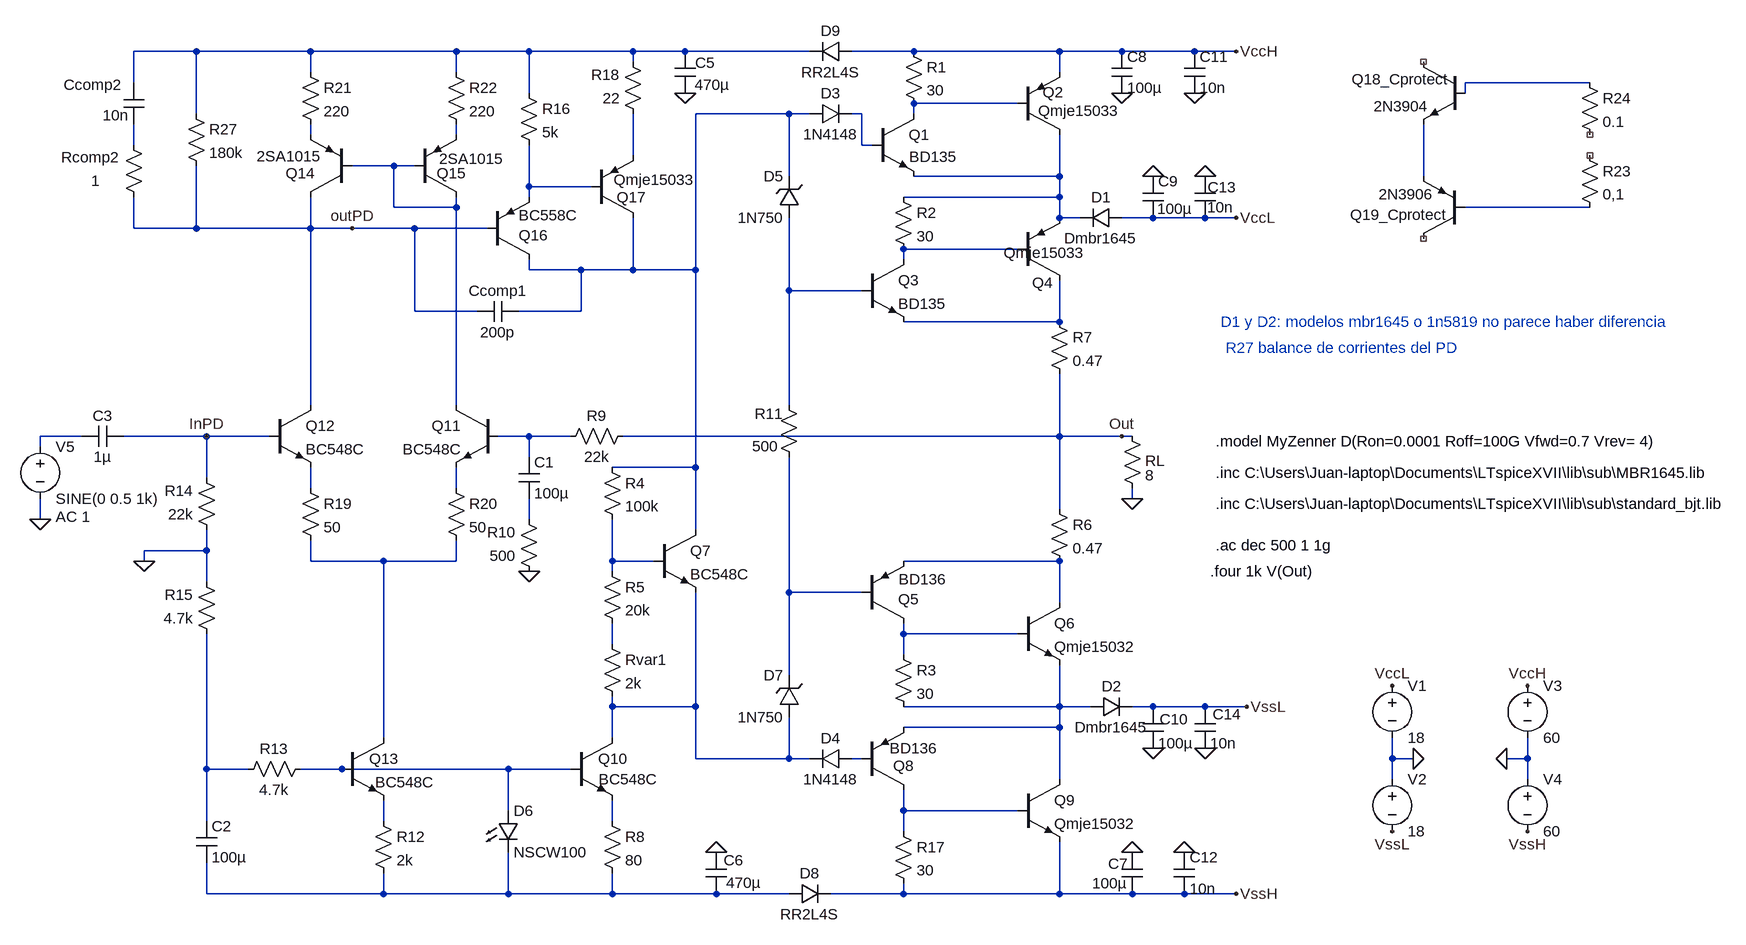
[diagram p0: schematic etapa_ampli_2Sziklai_mas_tension.asc]
etapa_ampli_2Sziklai_mas_tension.asc, the LTspice schematic file:
Version 4
SHEET 1 1872 1408
WIRE -912 48 -1008 48
WIRE -736 48 -912 48
WIRE -512 48 -736 48
WIRE -400 48 -512 48
WIRE -240 48 -400 48
WIRE -160 48 -240 48
WIRE 32 48 -160 48
WIRE 192 48 96 48
WIRE 416 48 192 48
WIRE 512 48 416 48
WIRE 624 48 512 48
WIRE 688 48 624 48
WIRE -240 64 -240 48
WIRE -736 80 -736 48
WIRE -512 80 -512 48
WIRE 416 80 416 48
WIRE -1008 96 -1008 48
WIRE 1232 96 1040 96
WIRE -400 112 -400 48
WIRE 1040 112 1040 96
WIRE 352 128 192 128
WIRE -912 144 -912 48
WIRE 0 144 -144 144
WIRE 32 144 0 144
WIRE 112 144 96 144
WIRE 192 144 192 128
WIRE -736 176 -736 160
WIRE -512 176 -512 160
WIRE -1008 192 -1008 160
WIRE 112 192 112 144
WIRE 128 192 112 192
WIRE -240 208 -240 144
WIRE -608 224 -672 224
WIRE -576 224 -608 224
WIRE 0 240 0 144
WIRE 416 240 416 176
WIRE 416 240 192 240
WIRE 976 240 976 160
WIRE -400 256 -400 192
WIRE -304 256 -400 256
WIRE -400 272 -400 256
WIRE 416 272 416 240
WIRE 416 272 176 272
WIRE -608 288 -608 224
WIRE -512 288 -512 272
WIRE -512 288 -608 288
WIRE 1232 288 1040 288
WIRE 416 304 416 272
WIRE 448 304 416 304
WIRE 560 304 512 304
WIRE 640 304 560 304
WIRE 688 304 640 304
WIRE -1008 320 -1008 272
WIRE -912 320 -912 224
WIRE -912 320 -1008 320
WIRE -736 320 -736 272
WIRE -736 320 -912 320
WIRE -672 320 -736 320
WIRE -576 320 -672 320
WIRE -464 320 -576 320
WIRE 352 352 176 352
WIRE 176 368 176 352
WIRE -400 384 -400 368
WIRE -320 384 -400 384
WIRE -240 384 -240 304
WIRE -240 384 -320 384
WIRE -144 384 -144 144
WIRE -144 384 -240 384
WIRE 0 416 0 304
WIRE 112 416 0 416
WIRE -576 448 -576 320
WIRE -480 448 -576 448
WIRE -320 448 -320 384
WIRE -320 448 -416 448
WIRE 416 464 416 400
WIRE 416 464 176 464
WIRE -736 592 -736 320
WIRE -512 592 -512 288
WIRE 0 592 0 416
WIRE -1088 640 -1152 640
WIRE -896 640 -1024 640
WIRE -800 640 -896 640
WIRE -400 640 -448 640
WIRE -336 640 -400 640
WIRE 416 640 416 544
WIRE 416 640 -256 640
WIRE 512 640 416 640
WIRE 528 640 512 640
WIRE -1152 656 -1152 640
WIRE -400 672 -400 640
WIRE -144 688 -144 384
WIRE -144 688 -272 688
WIRE -896 704 -896 640
WIRE -736 720 -736 688
WIRE -512 720 -512 688
WIRE 528 736 528 720
WIRE 416 752 416 640
WIRE -1152 768 -1152 736
WIRE -400 768 -400 736
WIRE -144 784 -144 688
WIRE -896 816 -896 784
WIRE -896 816 -992 816
WIRE -992 832 -992 816
WIRE -736 832 -736 800
WIRE -624 832 -736 832
WIRE -512 832 -512 800
WIRE -512 832 -624 832
WIRE -272 832 -272 768
WIRE -208 832 -272 832
WIRE 416 832 176 832
WIRE -272 848 -272 832
WIRE -896 864 -896 816
WIRE 0 880 0 672
WIRE 112 880 0 880
WIRE 416 896 416 832
WIRE 176 944 176 928
WIRE 352 944 176 944
WIRE -272 960 -272 928
WIRE 176 976 176 944
WIRE 0 1008 0 880
WIRE -272 1056 -272 1040
WIRE -144 1056 -144 880
WIRE -144 1056 -272 1056
WIRE 416 1056 416 992
WIRE 416 1056 176 1056
WIRE 464 1056 416 1056
WIRE 560 1056 528 1056
WIRE 640 1056 560 1056
WIRE 704 1056 640 1056
WIRE 416 1088 416 1056
WIRE 416 1088 176 1088
WIRE -624 1104 -624 832
WIRE -272 1104 -272 1056
WIRE -144 1136 -144 1056
WIRE 0 1136 0 1072
WIRE 0 1136 -144 1136
WIRE 32 1136 0 1136
WIRE 112 1136 96 1136
WIRE 928 1136 928 1104
WIRE 960 1136 928 1136
WIRE 1136 1136 1136 1104
WIRE 1136 1136 1104 1136
WIRE -896 1152 -896 944
WIRE -832 1152 -896 1152
WIRE -688 1152 -752 1152
WIRE -432 1152 -688 1152
WIRE -336 1152 -432 1152
WIRE 416 1168 416 1088
WIRE 928 1168 928 1136
WIRE 1136 1168 1136 1136
WIRE -432 1216 -432 1152
WIRE 176 1216 176 1184
WIRE 352 1216 176 1216
WIRE -896 1232 -896 1152
WIRE -624 1232 -624 1200
WIRE -272 1232 -272 1200
WIRE 176 1248 176 1216
WIRE -896 1344 -896 1296
WIRE -624 1344 -624 1312
WIRE -624 1344 -896 1344
WIRE -432 1344 -432 1280
WIRE -432 1344 -624 1344
WIRE -272 1344 -272 1312
WIRE -272 1344 -432 1344
WIRE -112 1344 -272 1344
WIRE 0 1344 -112 1344
WIRE 176 1344 176 1328
WIRE 176 1344 64 1344
WIRE 416 1344 416 1264
WIRE 416 1344 176 1344
WIRE 528 1344 416 1344
WIRE 608 1344 528 1344
WIRE 688 1344 608 1344
FLAG 688 304 VccL
FLAG 688 48 VccH
FLAG 528 736 0
FLAG 688 1344 VssH
FLAG 960 1136 0
FLAG 1104 1136 0
FLAG 1136 1024 VccH
FLAG 928 1024 VccL
FLAG 1136 1248 VssH
FLAG 928 1248 VssL
FLAG 512 640 Out
FLAG -400 848 0
FLAG -992 832 0
FLAG 704 1056 VssL
FLAG -896 640 InPD
FLAG -160 112 0
FLAG -112 1280 0
FLAG 560 1120 0
FLAG 528 1280 0
FLAG 560 240 0
FLAG 512 112 0
FLAG 624 112 0
FLAG 608 1280 0
FLAG 640 240 0
FLAG 640 1120 0
FLAG -672 320 outPD
FLAG -1152 768 0
SYMBOL npn 128 144 R0
WINDOW 3 57 66 Left 2
SYMATTR Value BD135
SYMATTR InstName Q1
SYMBOL npn 112 368 R0
SYMATTR InstName Q3
SYMATTR Value BD135
SYMBOL res 512 624 R0
WINDOW 0 36 54 Left 2
SYMATTR InstName RL
SYMATTR Value 8
SYMBOL pnp 112 928 M180
WINDOW 0 56 37 Left 2
WINDOW 3 57 68 Left 2
SYMATTR InstName Q5
SYMATTR Value BD136
SYMBOL pnp 112 1184 M180
WINDOW 0 48 37 Left 2
WINDOW 3 43 64 Left 2
SYMATTR InstName Q8
SYMATTR Value BD136
SYMBOL voltage 928 1008 R0
WINDOW 123 0 0 Left 0
WINDOW 39 0 0 Left 0
SYMATTR InstName V1
SYMATTR Value 18
SYMBOL voltage 928 1152 R0
WINDOW 123 0 0 Left 0
WINDOW 39 0 0 Left 0
SYMATTR InstName V2
SYMATTR Value 18
SYMBOL voltage 1136 1008 R0
WINDOW 123 0 0 Left 0
WINDOW 39 0 0 Left 0
SYMATTR InstName V3
SYMATTR Value 60
SYMBOL voltage 1136 1152 R0
WINDOW 123 0 0 Left 0
WINDOW 39 0 0 Left 0
SYMATTR InstName V4
SYMATTR Value 60
SYMBOL diode 32 160 R270
WINDOW 0 32 32 VTop 2
WINDOW 3 0 32 VBottom 2
SYMATTR InstName D3
SYMATTR Value 1N4148
SYMBOL diode 96 1120 R90
WINDOW 0 0 32 VBottom 2
WINDOW 3 32 32 VTop 2
SYMATTR InstName D4
SYMATTR Value 1N4148
SYMBOL npn -208 784 R0
SYMATTR InstName Q7
SYMATTR Value BC548C
SYMBOL res -288 672 R0
SYMATTR InstName R4
SYMATTR Value 100k
SYMBOL res -288 832 R0
SYMATTR InstName R5
SYMATTR Value 20k
SYMBOL npn -336 1104 R0
WINDOW 0 42 32 Left 2
WINDOW 3 43 64 Left 2
SYMATTR InstName Q10
SYMATTR Value BC548C
SYMBOL res -288 1216 R0
SYMATTR InstName R8
SYMATTR Value 80
SYMBOL npn -448 592 M0
SYMATTR InstName Q11
SYMATTR Value BC548C
SYMBOL res -240 624 R90
WINDOW 0 0 56 VBottom 2
WINDOW 3 32 56 VTop 2
SYMATTR InstName R9
SYMATTR Value 22k
SYMBOL res -384 864 R180
WINDOW 0 36 76 Left 2
WINDOW 3 36 40 Left 2
SYMATTR InstName R10
SYMATTR Value 500
SYMBOL cap -416 672 R0
SYMATTR InstName C1
SYMATTR Value 100µ
SYMBOL res -16 576 R0
WINDOW 0 -37 29 Left 2
WINDOW 3 -41 79 Left 2
SYMATTR InstName R11
SYMATTR Value 500
SYMBOL npn -800 592 R0
SYMATTR InstName Q12
SYMATTR Value BC548C
SYMBOL npn -688 1104 R0
WINDOW 0 42 32 Left 2
WINDOW 3 51 68 Left 2
SYMATTR InstName Q13
SYMATTR Value BC548C
SYMBOL res -640 1216 R0
SYMATTR InstName R12
SYMATTR Value 2k
SYMBOL res -736 1136 R90
WINDOW 0 0 56 VBottom 2
WINDOW 3 32 56 VTop 2
SYMATTR InstName R13
SYMATTR Value 4.7k
SYMBOL res -880 800 R180
WINDOW 0 36 76 Left 2
WINDOW 3 36 40 Left 2
SYMATTR InstName R14
SYMATTR Value 22k
SYMBOL res -880 960 R180
WINDOW 0 36 76 Left 2
WINDOW 3 36 40 Left 2
SYMATTR InstName R15
SYMATTR Value 4.7k
SYMBOL cap -912 1232 R0
SYMATTR InstName C2
SYMATTR Value 100µ
SYMBOL cap -1024 624 R90
WINDOW 0 0 32 VBottom 2
WINDOW 3 32 32 VTop 2
SYMATTR InstName C3
SYMATTR Value 1µ
SYMBOL pnp -672 272 R180
WINDOW 0 57 37 Left 2
WINDOW 3 48 63 Left 2
SYMATTR InstName Q14
SYMATTR Value 2SA1015
SYMBOL pnp -576 272 M180
WINDOW 0 34 37 Left 2
WINDOW 3 38 59 Left 2
SYMATTR InstName Q15
SYMATTR Value 2SA1015
SYMBOL res -416 96 R0
SYMATTR InstName R16
SYMATTR Value 5k
SYMBOL pnp -464 368 M180
WINDOW 0 48 37 Left 2
WINDOW 3 48 68 Left 2
SYMATTR InstName Q16
SYMATTR Value BC558C
SYMBOL zener 16 1072 R180
WINDOW 0 24 64 Left 2
WINDOW 3 24 0 Left 2
SYMATTR InstName D7
SYMATTR Value 1N750
SYMBOL zener 16 304 R180
WINDOW 0 24 64 Left 2
WINDOW 3 24 0 Left 2
SYMATTR InstName D5
SYMATTR Value 1N750
SYMBOL LED -448 1216 R0
SYMATTR InstName D6
SYMATTR Value NSCW100
SYMBOL npn 352 896 R0
SYMATTR InstName Q6
SYMATTR Value Qmje15032
SYMBOL res 160 960 R0
SYMATTR InstName R3
SYMATTR Value 30
SYMBOL npn 352 1168 R0
SYMATTR InstName Q9
SYMATTR Value Qmje15032
SYMBOL res 160 1232 R0
SYMATTR InstName R17
SYMATTR Value 30
SYMBOL res -224 160 R180
WINDOW 0 36 76 Left 2
WINDOW 3 36 40 Left 2
SYMATTR InstName R18
SYMATTR Value 22
SYMBOL pnp -304 304 M180
WINDOW 0 39 32 Left 2
WINDOW 3 34 59 Left 2
SYMATTR InstName Q17
SYMATTR Value Qmje15033
SYMBOL cap -416 432 R90
WINDOW 0 0 32 VBottom 2
WINDOW 3 32 32 VTop 2
SYMATTR InstName Ccomp1
SYMATTR Value 200p
SYMBOL diode 0 1360 R270
WINDOW 0 32 32 VTop 2
WINDOW 3 0 32 VBottom 2
SYMATTR InstName D8
SYMATTR Value RR2L4S
SYMBOL diode 96 32 R90
WINDOW 0 0 32 VBottom 2
WINDOW 3 32 32 VTop 2
SYMATTR InstName D9
SYMATTR Value RR2L4S
SYMBOL cap -144 112 R180
WINDOW 0 -30 47 Left 2
WINDOW 3 -53 13 Left 2
SYMATTR InstName C5
SYMATTR Value 470µ
SYMBOL cap -96 1344 R180
WINDOW 0 -26 52 Left 2
WINDOW 3 -53 17 Left 2
SYMATTR InstName C6
SYMATTR Value 470µ
SYMBOL cap 512 1280 R0
WINDOW 0 -21 18 Left 2
WINDOW 3 -46 48 Left 2
SYMATTR InstName C7
SYMATTR Value 100µ
SYMBOL cap 496 48 R0
SYMATTR InstName C8
SYMATTR Value 100µ
SYMBOL cap 544 240 R0
WINDOW 3 22 50 Left 2
SYMATTR Value 100µ
SYMATTR InstName C9
SYMBOL cap 544 1056 R0
WINDOW 0 26 19 Left 2
SYMATTR InstName C10
SYMATTR Value 100µ
SYMBOL res -752 64 R0
SYMATTR InstName R21
SYMATTR Value 220
SYMBOL res -528 64 R0
SYMATTR InstName R22
SYMATTR Value 220
SYMBOL cap 608 48 R0
SYMATTR InstName C11
SYMATTR Value 10n
SYMBOL cap 592 1280 R0
SYMATTR InstName C12
SYMATTR Value 10n
SYMBOL cap 624 240 R0
WINDOW 0 20 17 Left 2
WINDOW 3 19 48 Left 2
SYMATTR InstName C13
SYMATTR Value 10n
SYMBOL cap 624 1056 R0
WINDOW 0 28 12 Left 2
SYMATTR InstName C14
SYMATTR Value 10n
SYMBOL pnp 352 176 M180
WINDOW 0 38 65 Left 2
WINDOW 3 31 37 Left 2
SYMATTR InstName Q2
SYMATTR Value Qmje15033
SYMBOL pnp 352 400 M180
WINDOW 0 22 -4 Left 2
WINDOW 3 -22 42 Left 2
SYMATTR InstName Q4
SYMATTR Value Qmje15033
SYMBOL res 176 32 R0
SYMATTR InstName R1
SYMATTR Value 30
SYMBOL res 160 256 R0
SYMATTR InstName R2
SYMATTR Value 30
SYMBOL res 400 736 R0
SYMATTR InstName R6
SYMATTR Value 0.47
SYMBOL res 400 448 R0
SYMATTR InstName R7
SYMATTR Value 0.47
SYMBOL res -288 944 R0
SYMATTR InstName Rvar1
SYMATTR Value 2k
SYMBOL diode 464 1072 R270
WINDOW 0 32 32 VTop 2
WINDOW 3 0 32 VBottom 2
SYMATTR InstName D2
SYMATTR Value Dmbr1645
SYMBOL diode 512 288 R90
WINDOW 0 0 32 VBottom 2
WINDOW 3 32 32 VTop 2
SYMATTR InstName D1
SYMATTR Value Dmbr1645
SYMBOL npn 1040 64 M0
WINDOW 0 24 27 Left 2
SYMATTR InstName Q18_Cprotect
SYMATTR Value 2N3904
SYMBOL pnp 1040 336 R180
WINDOW 0 26 37 Left 2
WINDOW 3 48 68 Left 2
SYMATTR InstName Q19_Cprotect
SYMATTR Value 2N3906
SYMBOL res 1216 192 R0
SYMATTR InstName R23
SYMATTR Value 0,1
SYMBOL res 1216 80 R0
SYMATTR InstName R24
SYMATTR Value 0.1
SYMBOL cap -1024 96 R0
WINDOW 0 -92 3 Left 2
WINDOW 3 -32 50 Left 2
SYMATTR InstName Ccomp2
SYMATTR Value 10n
SYMBOL res -1024 176 R0
WINDOW 0 -96 35 Left 2
WINDOW 3 -50 71 Left 2
SYMATTR InstName Rcomp2
SYMATTR Value 1
SYMBOL res -752 704 R0
SYMATTR InstName R19
SYMATTR Value 50
SYMBOL res -528 704 R0
SYMATTR InstName R20
SYMATTR Value 50
SYMBOL res -928 128 R0
SYMATTR InstName R27
SYMATTR Value 180k
SYMBOL voltage -1152 640 R0
WINDOW 123 24 124 Left 2
WINDOW 39 0 0 Left 0
SYMATTR Value2 AC 1
SYMATTR InstName V5
SYMATTR Value SINE(0 0.5 1k)
TEXT 656 744 Left 2 !.inc C:\\Users\\Juan-laptop\\Documents\\LTspiceXVII\\lib\\sub\\standard_bjt.lib
TEXT 656 808 Left 2 !.ac dec 500 1 1g
TEXT 656 648 Left 2 !.model MyZenner D(Ron=0.0001 Roff=100G Vfwd=0.7 Vrev= 4)
TEXT 648 848 Left 2 !.four 1k V(Out)
TEXT 656 696 Left 2 !.inc C:\\Users\\Juan-laptop\\Documents\\LTspiceXVII\\lib\\sub\\MBR1645.lib
TEXT 664 464 Left 2 ;D1 y D2: modelos mbr1645 o 1n5819 no parece haber diferencia
TEXT 672 504 Left 2 ;R27 balance de corrientes del PD

The netlist it stands for:
* etapa_ampli_2Sziklai_mas_tension.asc
Q1 N003 N005 N011 0 BD135
Q3 N015 N016 N017 0 BD135
RL Out 0 8
Q5 N027 N026 N025 0 BD136
Q8 N034 N031 N030 0 BD136
V1 VccL 0 18
V2 0 VssL 18
V3 VccH 0 60
V4 0 VssH 60
D3 N004 N005 1N4148
D4 N031 N029 1N4148
Q7 N004 N024 N029 0 BC548C
R4 N004 N024 100k
R5 N024 N028 20k
Q10 N029 N033 N036 0 BC548C
R8 N036 N037 80
Q11 N010 N019 N021 0 BC548C
R9 Out N019 22k
R10 0 N022 500
C1 N019 N022 100µ
R11 N016 N026 500
Q12 outPD InPD N020 0 BC548C
Q13 N023 N033 N035 0 BC548C
R12 N035 N037 2k
R13 N033 N032 4.7k
R14 0 InPD 22k
R15 N032 0 4.7k
C2 N032 N037 100µ
C3 InPD N018 1µ
Q14 outPD N010 N006 0 2SA1015
Q15 N010 N010 N007 0 2SA1015
R16 N001 N013 5k
Q16 N004 outPD N013 0 BC558C
D7 N029 N026 1N750
D5 N016 N004 1N750
D6 N033 N037 NSCW100
Q6 N025 N027 N030 0 Qmje15032
R3 N027 N030 30
Q9 N030 N034 VssH 0 Qmje15032
R17 N034 VssH 30
R18 N009 N001 22
Q17 N004 N013 N009 0 Qmje15033
Ccomp1 N004 outPD 200p
D8 N037 VssH RR2L4S
D9 VccH N001 RR2L4S
C5 0 N001 470µ
C6 N037 0 470µ
C7 0 VssH 100µ
C8 VccH 0 100µ
C9 0 VccL 100µ
C10 VssL 0 100µ
R21 N001 N006 220
R22 N001 N007 220
C11 VccH 0 10n
C12 0 VssH 10n
C13 0 VccL 10n
C14 VssL 0 10n
Q2 N011 N003 VccH 0 Qmje15033
Q4 N017 N015 N011 0 Qmje15033
R1 VccH N003 30
R2 N011 N015 30
R6 Out N025 0.47
R7 N017 Out 0.47
Rvar1 N028 N029 2k
D2 N030 VssL Dmbr1645
D1 VccL N011 Dmbr1645
Q18_Cprotect NC_01 N002 N012 0 2N3904
Q19_Cprotect NC_02 N014 N012 0 2N3906
R23 NC_03 N014 0,1
R24 N002 NC_04 0.1
Ccomp2 N001 N008 10n
Rcomp2 N008 outPD 1
R19 N020 N023 50
R20 N021 N023 50
R27 N001 outPD 180k
V5 N018 0 SINE(0 0.5 1k) AC 1
.model D D
.lib standard.dio
.model NPN NPN
.model PNP PNP
.lib standard.bjt
.inc C:\Users\Juan-laptop\Documents\LTspiceXVII\lib\sub\standard_bjt.lib
.ac dec 500 1 1g
.model MyZenner D(Ron=0.0001 Roff=100G Vfwd=0.7 Vrev= 4)
.four 1k V(Out)
.inc C:\Users\Juan-laptop\Documents\LTspiceXVII\lib\sub\MBR1645.lib
* D1 y D2: modelos mbr1645 o 1n5819 no parece haber diferencia
* R27 balance de corrientes del PD
.backanno
.end